# Altium schematic sheet TOP_Sheet.SchDoc
size 431 x 279 mm; DrawnBy: Santiago Rodriguez; DocumentNumber: 2; Revision: V1; SheetNumber: 3; SheetTotal: 10
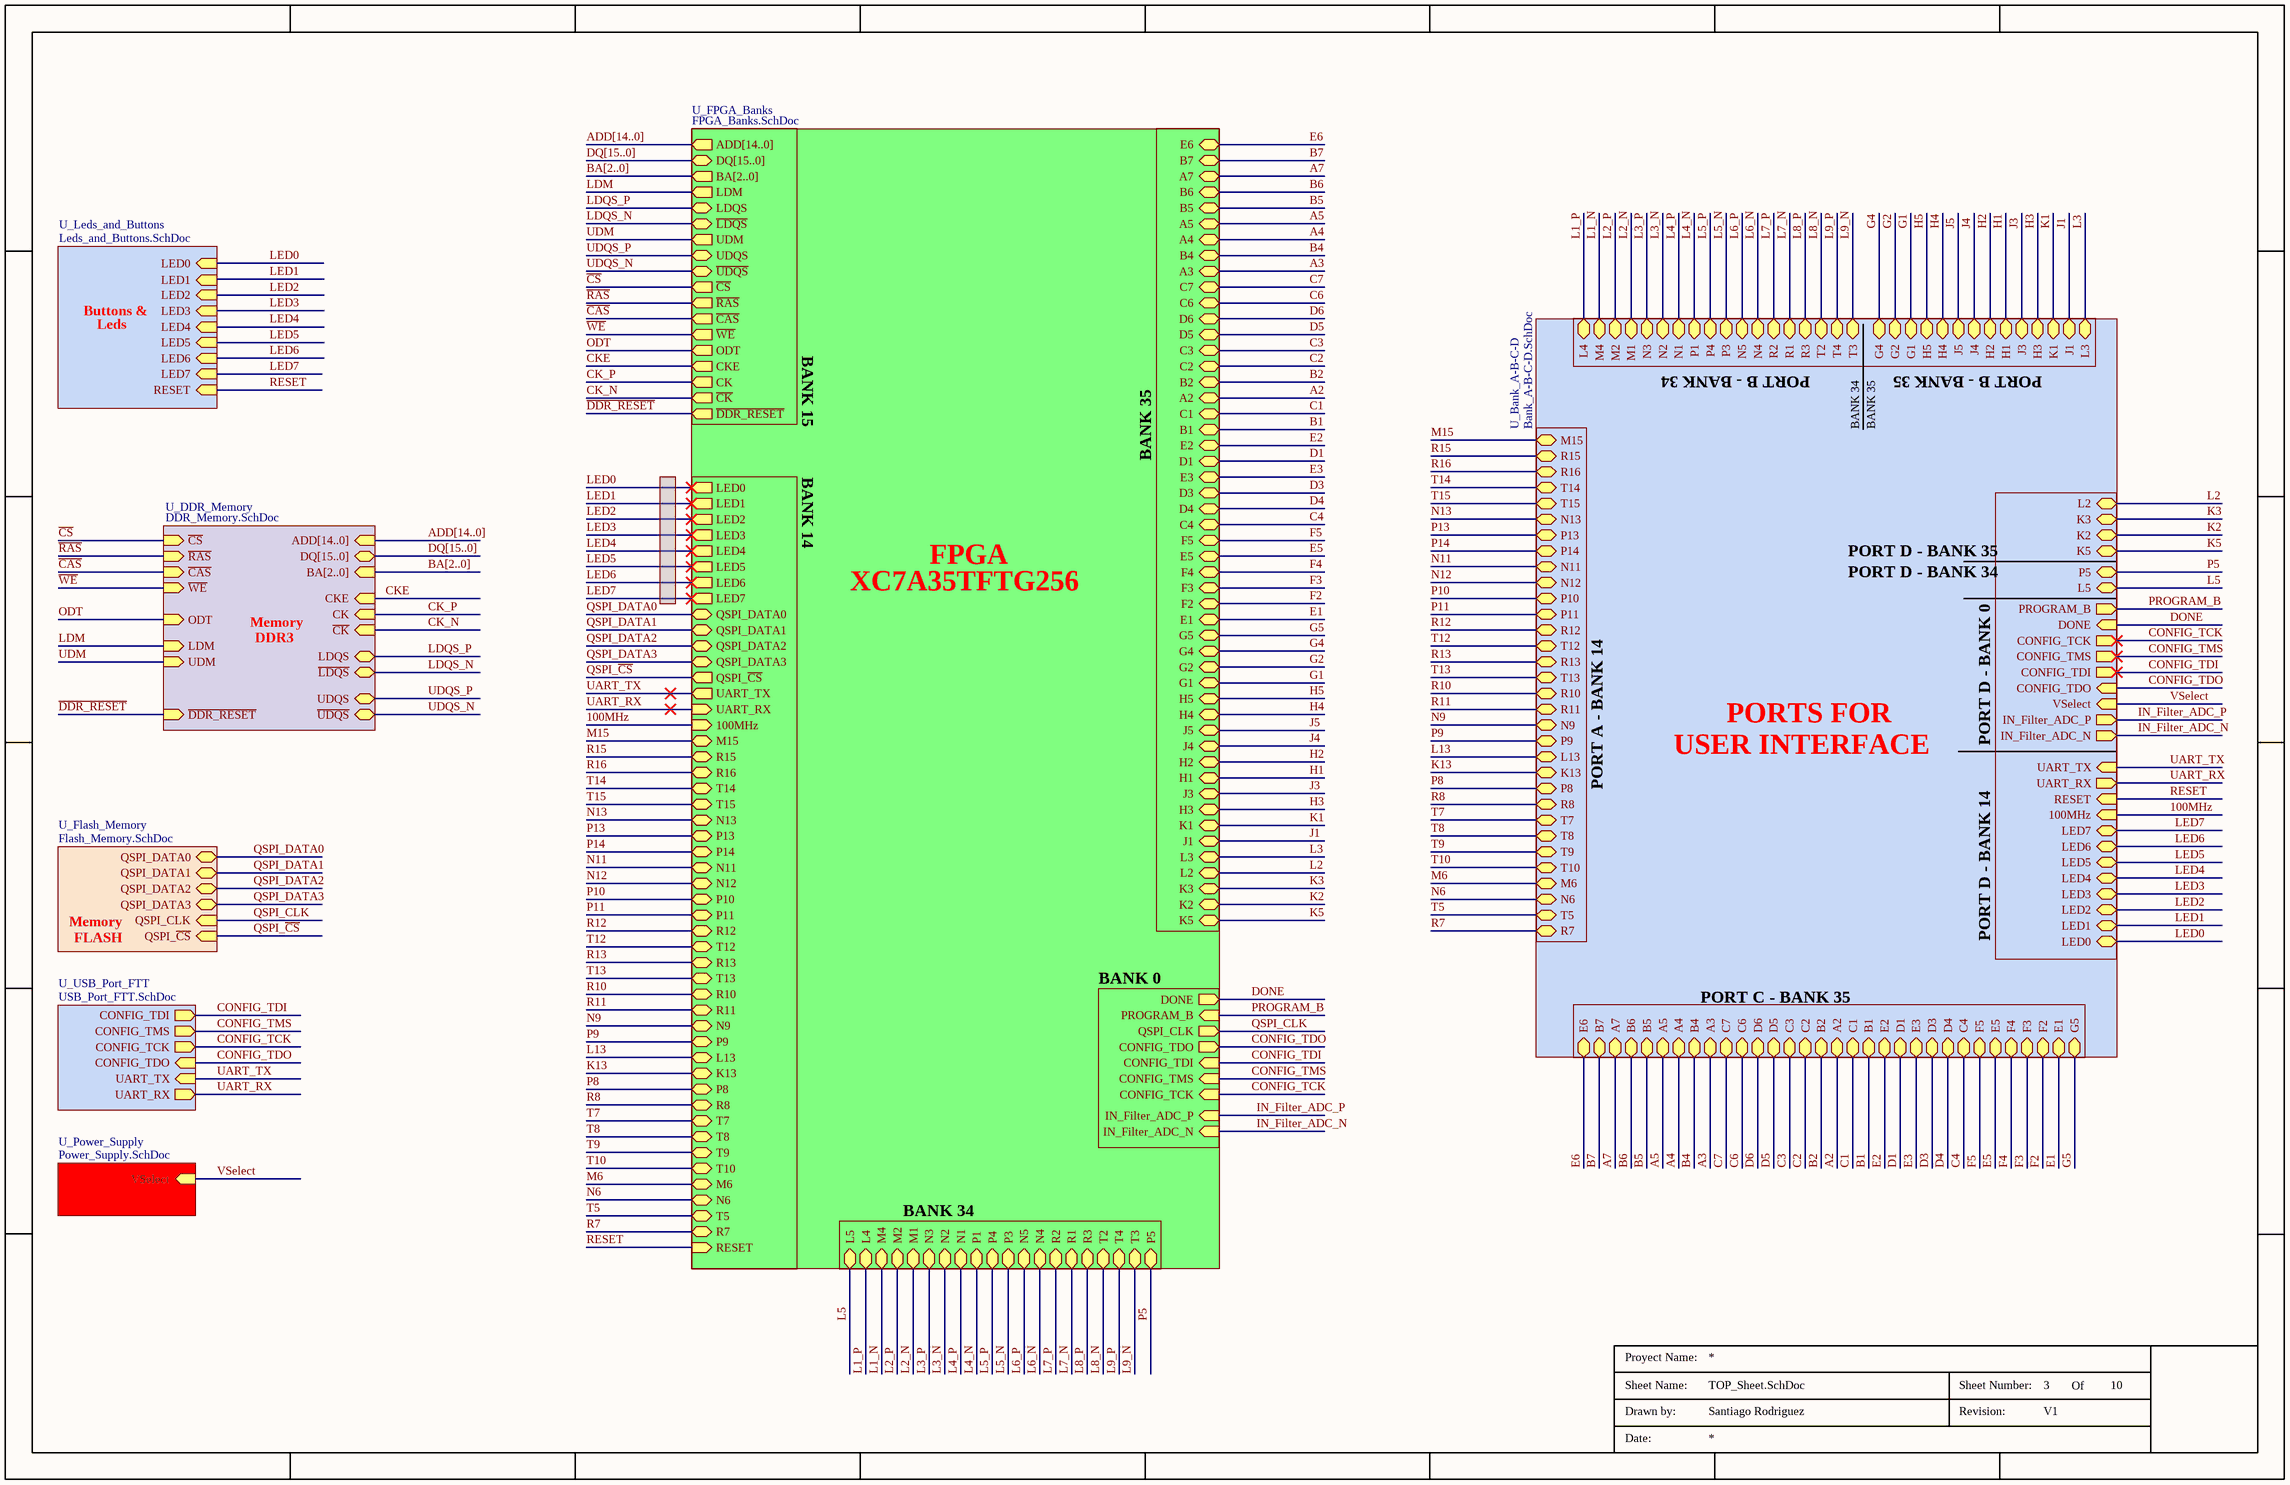
[diagram p0: TOP_Sheet.SchDoc]

## Sub-sheets
U_Bank_A-B-C-D = Bank_A-B-C-D.SchDoc: UART_TX (in), UART_RX (out), LED1 (bidir), LED2 (bidir), LED3 (bidir), LED4 (bidir), LED5 (bidir), LED6 (bidir), LED7 (bidir), 100MHz (in), LED0 (bidir), RESET (in), CONFIG_TDO (in), CONFIG_TDI (out), CONFIG_TMS (out), CONFIG_TCK (out), R1 (bidir), R2 (bidir), R3 (bidir), N1 (bidir), N2 (bidir), N3 (bidir), P1 (bidir), N4 (bidir), N5 (bidir), P3 (bidir), P4 (bidir), M1 (bidir), M2 (bidir), L4 (bidir), L5 (bidir), M4 (bidir), T2 (bidir), T3 (bidir), T4 (bidir), P5 (bidir), E6 (bidir), B7 (bidir), A7 (bidir), B5 (bidir), B6 (bidir), A4 (bidir), A5 (bidir), B4 (bidir), A3 (bidir), C1 (bidir), D1 (bidir), D3 (bidir), D4 (bidir), C2 (bidir), C3 (bidir), C4 (bidir), E5 (bidir), F4 (bidir), F5 (bidir), F2 (bidir), F3 (bidir), G1 (bidir), G2 (bidir), E1 (bidir), G4 (bidir), G5 (bidir), E2 (bidir), E3 (bidir), B1 (bidir), B2 (bidir), A2 (bidir), C6 (bidir), C7 (bidir), D5 (bidir), D6 (bidir), J1 (bidir), K1 (bidir), H1 (bidir), H2 (bidir), L2 (bidir), L3 (bidir), K2 (bidir), K3 (bidir), K5 (bidir), H3 (bidir), H4 (bidir), H5 (bidir), J3 (bidir), J4 (bidir), J5 (bidir), DONE (in), PROGRAM_B (out), IN_Filter_ADC_P (out), IN_Filter_ADC_N (out), VSelect (in), K13 (bidir), R15 (bidir), R16 (bidir), T14 (bidir), T15 (bidir), N13 (bidir), P13 (bidir), P14 (bidir), N11 (bidir), N12 (bidir), P10 (bidir), P11 (bidir), R12 (bidir), T12 (bidir), R13 (bidir), T13 (bidir), R10 (bidir), R11 (bidir), N9 (bidir), P9 (bidir), M6 (bidir), L13 (bidir), P8 (bidir), R8 (bidir), T7 (bidir), T8 (bidir), T9 (bidir), T10 (bidir), T5 (bidir), N6 (bidir), M15 (bidir), R7 (bidir)
U_DDR_Memory = DDR_Memory.SchDoc: CKE (in), ~{CK} (in), CK (in), ~{CS} (in), ~{RAS} (in), ~{CAS} (in), ~{WE} (in), ADD[14..0] (in), DQ[15..0] (bidir), LDQS (bidir), ~{LDQS} (bidir), UDQS (bidir), ~{UDQS} (bidir), ODT (in), ~{DDR_RESET} (in), LDM (in), UDM (in), BA[2..0] (in)
U_Flash_Memory = Flash_Memory.SchDoc: QSPI_DATA0 (bidir), QSPI_DATA1 (bidir), QSPI_DATA2 (bidir), QSPI_DATA3 (bidir), QSPI_CLK (in), QSPI_~{CS} (in)
U_FPGA_Banks = FPGA_Banks.SchDoc: QSPI_DATA0 (bidir), QSPI_DATA1 (bidir), QSPI_DATA2 (bidir), QSPI_DATA3 (bidir), QSPI_~{CS} (out), UART_TX (out), UART_RX (in), LED1 (out), LED2 (out), LED3 (out), LED4 (out), LED5 (out), LED6 (out), LED7 (out), K13 (bidir), 100MHz (in), R15 (bidir), R16 (bidir), T14 (bidir), T15 (bidir), N13 (bidir), P13 (bidir), P14 (bidir), N11 (bidir), N12 (bidir), P10 (bidir), P11 (bidir), R12 (bidir), T12 (bidir), R13 (bidir), T13 (bidir), R10 (bidir), R11 (bidir), N9 (bidir), P9 (bidir), M6 (bidir), L13 (bidir), P8 (bidir), R8 (bidir), T7 (bidir), T8 (bidir), T9 (bidir), T10 (bidir), T5 (bidir), N6 (bidir), M15 (bidir), R7 (bidir), RESET (in), ODT (out), ~{DDR_RESET} (out), ADD[14..0] (out), BA[2..0] (out), CKE (out), ~{CK} (out), CK (out), ~{CS} (out), ~{RAS} (out), ~{CAS} (out), ~{WE} (out), E6 (bidir), B7 (bidir), A7 (bidir), B5 (bidir), B6 (bidir), A4 (bidir), A5 (bidir), B4 (bidir), A3 (bidir), C1 (bidir), D1 (bidir), D3 (bidir), D4 (bidir), C2 (bidir), C3 (bidir), C4 (bidir), E5 (bidir), F4 (bidir), F5 (bidir), F2 (bidir), F3 (bidir), G1 (bidir), G2 (bidir), E1 (bidir), G4 (bidir), G5 (bidir), E2 (bidir), E3 (bidir), B1 (bidir), B2 (bidir), A2 (bidir), C6 (bidir), C7 (bidir), D5 (bidir), D6 (bidir), J1 (bidir), K1 (bidir), H1 (bidir), H2 (bidir), L2 (bidir), L3 (bidir), K2 (bidir), K3 (bidir), K5 (bidir), H3 (bidir), H4 (bidir), H5 (bidir), J3 (bidir), J4 (bidir), J5 (bidir), DQ[15..0] (bidir), LDQS (bidir), ~{LDQS} (bidir), UDQS (bidir), ~{UDQS} (bidir), UDM (out), LDM (out), LED0 (out), R1 (bidir), R2 (bidir), R3 (bidir), N1 (bidir), N2 (bidir), N3 (bidir), P1 (bidir), N4 (bidir), N5 (bidir), P3 (bidir), P4 (bidir), M1 (bidir), M2 (bidir), L4 (bidir), L5 (bidir), M4 (bidir), T2 (bidir), T3 (bidir), T4 (bidir), P5 (bidir), CONFIG_TDO (out), CONFIG_TDI (in), CONFIG_TMS (in), CONFIG_TCK (in), QSPI_CLK (out), DONE (out), PROGRAM_B (in), IN_Filter_ADC_P (in), IN_Filter_ADC_N (in)
U_Leds_and_Buttons = Leds_and_Buttons.SchDoc: LED0 (in), LED1 (in), LED2 (in), LED3 (in), LED4 (in), LED5 (in), LED6 (in), LED7 (in), RESET (in)
U_Power_Supply = Power_Supply.SchDoc: VSelect (in)
U_USB_Port_FTT = USB_Port_FTT.SchDoc: CONFIG_TDO (in), CONFIG_TDI (out), CONFIG_TMS (out), CONFIG_TCK (out), UART_TX (in), UART_RX (out)

## Nets
100MHz: sheet U_Bank_A-B-C-D/100MHz, sheet U_FPGA_Banks/100MHz
A2: sheet U_Bank_A-B-C-D/A2, sheet U_FPGA_Banks/A2
A3: sheet U_Bank_A-B-C-D/A3, sheet U_FPGA_Banks/A3
A4: sheet U_Bank_A-B-C-D/A4, sheet U_FPGA_Banks/A4
A5: sheet U_Bank_A-B-C-D/A5, sheet U_FPGA_Banks/A5
A7: sheet U_Bank_A-B-C-D/A7, sheet U_FPGA_Banks/A7
B1: sheet U_Bank_A-B-C-D/B1, sheet U_FPGA_Banks/B1
B2: sheet U_Bank_A-B-C-D/B2, sheet U_FPGA_Banks/B2
B4: sheet U_Bank_A-B-C-D/B4, sheet U_FPGA_Banks/B4
B5: sheet U_Bank_A-B-C-D/B5, sheet U_FPGA_Banks/B5
B6: sheet U_Bank_A-B-C-D/B6, sheet U_FPGA_Banks/B6
B7: sheet U_Bank_A-B-C-D/B7, sheet U_FPGA_Banks/B7
C1: sheet U_Bank_A-B-C-D/C1, sheet U_FPGA_Banks/C1
C2: sheet U_Bank_A-B-C-D/C2, sheet U_FPGA_Banks/C2
C3: sheet U_Bank_A-B-C-D/C3, sheet U_FPGA_Banks/C3
C4: sheet U_Bank_A-B-C-D/C4, sheet U_FPGA_Banks/C4
C6: sheet U_Bank_A-B-C-D/C6, sheet U_FPGA_Banks/C6
C7: sheet U_Bank_A-B-C-D/C7, sheet U_FPGA_Banks/C7
~{CAS}: sheet U_DDR_Memory/~{CAS}, sheet U_FPGA_Banks/~{CAS}
~{CS}: sheet U_DDR_Memory/~{CS}, sheet U_FPGA_Banks/~{CS}
CK_N: sheet U_DDR_Memory/~{CK}, sheet U_FPGA_Banks/~{CK}
CK_P: sheet U_DDR_Memory/CK, sheet U_FPGA_Banks/CK
CKE: sheet U_DDR_Memory/CKE, sheet U_FPGA_Banks/CKE
CONFIG_TCK: sheet U_Bank_A-B-C-D/CONFIG_TCK, sheet U_FPGA_Banks/CONFIG_TCK, sheet U_USB_Port_FTT/CONFIG_TCK
CONFIG_TDI: sheet U_Bank_A-B-C-D/CONFIG_TDI, sheet U_FPGA_Banks/CONFIG_TDI, sheet U_USB_Port_FTT/CONFIG_TDI
CONFIG_TDO: sheet U_Bank_A-B-C-D/CONFIG_TDO, sheet U_FPGA_Banks/CONFIG_TDO, sheet U_USB_Port_FTT/CONFIG_TDO
CONFIG_TMS: sheet U_Bank_A-B-C-D/CONFIG_TMS, sheet U_FPGA_Banks/CONFIG_TMS, sheet U_USB_Port_FTT/CONFIG_TMS
D1: sheet U_Bank_A-B-C-D/D1, sheet U_FPGA_Banks/D1
D3: sheet U_Bank_A-B-C-D/D3, sheet U_FPGA_Banks/D3
D4: sheet U_Bank_A-B-C-D/D4, sheet U_FPGA_Banks/D4
D5: sheet U_Bank_A-B-C-D/D5, sheet U_FPGA_Banks/D5
D6: sheet U_Bank_A-B-C-D/D6, sheet U_FPGA_Banks/D6
~{DDR_RESET}: sheet U_DDR_Memory/~{DDR_RESET}, sheet U_FPGA_Banks/~{DDR_RESET}
DONE: sheet U_Bank_A-B-C-D/DONE, sheet U_FPGA_Banks/DONE
E1: sheet U_Bank_A-B-C-D/E1, sheet U_FPGA_Banks/E1
E2: sheet U_Bank_A-B-C-D/E2, sheet U_FPGA_Banks/E2
E3: sheet U_Bank_A-B-C-D/E3, sheet U_FPGA_Banks/E3
E5: sheet U_Bank_A-B-C-D/E5, sheet U_FPGA_Banks/E5
E6: sheet U_Bank_A-B-C-D/E6, sheet U_FPGA_Banks/E6
F2: sheet U_Bank_A-B-C-D/F2, sheet U_FPGA_Banks/F2
F3: sheet U_Bank_A-B-C-D/F3, sheet U_FPGA_Banks/F3
F4: sheet U_Bank_A-B-C-D/F4, sheet U_FPGA_Banks/F4
F5: sheet U_Bank_A-B-C-D/F5, sheet U_FPGA_Banks/F5
G1: sheet U_Bank_A-B-C-D/G1, sheet U_FPGA_Banks/G1
G2: sheet U_Bank_A-B-C-D/G2, sheet U_FPGA_Banks/G2
G4: sheet U_Bank_A-B-C-D/G4, sheet U_FPGA_Banks/G4
G5: sheet U_Bank_A-B-C-D/G5, sheet U_FPGA_Banks/G5
H1: sheet U_Bank_A-B-C-D/H1, sheet U_FPGA_Banks/H1
H2: sheet U_Bank_A-B-C-D/H2, sheet U_FPGA_Banks/H2
H3: sheet U_Bank_A-B-C-D/H3, sheet U_FPGA_Banks/H3
H4: sheet U_Bank_A-B-C-D/H4, sheet U_FPGA_Banks/H4
H5: sheet U_Bank_A-B-C-D/H5, sheet U_FPGA_Banks/H5
IN_Filter_ADC_N: sheet U_Bank_A-B-C-D/IN_Filter_ADC_N, sheet U_FPGA_Banks/IN_Filter_ADC_N
IN_Filter_ADC_P: sheet U_Bank_A-B-C-D/IN_Filter_ADC_P, sheet U_FPGA_Banks/IN_Filter_ADC_P
J1: sheet U_Bank_A-B-C-D/J1, sheet U_FPGA_Banks/J1
J3: sheet U_Bank_A-B-C-D/J3, sheet U_FPGA_Banks/J3
J4: sheet U_Bank_A-B-C-D/J4, sheet U_FPGA_Banks/J4
J5: sheet U_Bank_A-B-C-D/J5, sheet U_FPGA_Banks/J5
K1: sheet U_Bank_A-B-C-D/K1, sheet U_FPGA_Banks/K1
K2: sheet U_Bank_A-B-C-D/K2, sheet U_FPGA_Banks/K2
K3: sheet U_Bank_A-B-C-D/K3, sheet U_FPGA_Banks/K3
K5: sheet U_Bank_A-B-C-D/K5, sheet U_FPGA_Banks/K5
K13: sheet U_Bank_A-B-C-D/K13, sheet U_FPGA_Banks/K13
L1_N: sheet U_Bank_A-B-C-D/M4, sheet U_FPGA_Banks/M4
L1_P: sheet U_Bank_A-B-C-D/L4, sheet U_FPGA_Banks/L4
L2: sheet U_Bank_A-B-C-D/L2, sheet U_FPGA_Banks/L2
L2_N: sheet U_Bank_A-B-C-D/M1, sheet U_FPGA_Banks/M1
L2_P: sheet U_Bank_A-B-C-D/M2, sheet U_FPGA_Banks/M2
L3: sheet U_Bank_A-B-C-D/L3, sheet U_FPGA_Banks/L3
L3_N: sheet U_Bank_A-B-C-D/N2, sheet U_FPGA_Banks/N2
L3_P: sheet U_Bank_A-B-C-D/N3, sheet U_FPGA_Banks/N3
L4_N: sheet U_Bank_A-B-C-D/P1, sheet U_FPGA_Banks/P1
L4_P: sheet U_Bank_A-B-C-D/N1, sheet U_FPGA_Banks/N1
L5: sheet U_Bank_A-B-C-D/L5, sheet U_FPGA_Banks/L5
L5_N: sheet U_Bank_A-B-C-D/P3, sheet U_FPGA_Banks/P3
L5_P: sheet U_Bank_A-B-C-D/P4, sheet U_FPGA_Banks/P4
L6_N: sheet U_Bank_A-B-C-D/N4, sheet U_FPGA_Banks/N4
L6_P: sheet U_Bank_A-B-C-D/N5, sheet U_FPGA_Banks/N5
L7_N: sheet U_Bank_A-B-C-D/R1, sheet U_FPGA_Banks/R1
L7_P: sheet U_Bank_A-B-C-D/R2, sheet U_FPGA_Banks/R2
L8_N: sheet U_Bank_A-B-C-D/T2, sheet U_FPGA_Banks/T2
L8_P: sheet U_Bank_A-B-C-D/R3, sheet U_FPGA_Banks/R3
L9_N: sheet U_Bank_A-B-C-D/T3, sheet U_FPGA_Banks/T3
L9_P: sheet U_Bank_A-B-C-D/T4, sheet U_FPGA_Banks/T4
L13: sheet U_Bank_A-B-C-D/L13, sheet U_FPGA_Banks/L13
LDM: sheet U_DDR_Memory/LDM, sheet U_FPGA_Banks/LDM
LDQS_N: sheet U_DDR_Memory/~{LDQS}, sheet U_FPGA_Banks/~{LDQS}
LDQS_P: sheet U_DDR_Memory/LDQS, sheet U_FPGA_Banks/LDQS
LED0: sheet U_Bank_A-B-C-D/LED0, sheet U_FPGA_Banks/LED0, sheet U_Leds_and_Buttons/LED0
LED1: sheet U_Bank_A-B-C-D/LED1, sheet U_FPGA_Banks/LED1
LED2: sheet U_Bank_A-B-C-D/LED2, sheet U_FPGA_Banks/LED2, sheet U_Leds_and_Buttons/LED2
LED3: sheet U_Bank_A-B-C-D/LED3, sheet U_FPGA_Banks/LED3, sheet U_Leds_and_Buttons/LED3
LED4: sheet U_Bank_A-B-C-D/LED4, sheet U_FPGA_Banks/LED4, sheet U_Leds_and_Buttons/LED4
LED5: sheet U_Bank_A-B-C-D/LED5, sheet U_FPGA_Banks/LED5, sheet U_Leds_and_Buttons/LED5
LED6: sheet U_Bank_A-B-C-D/LED6, sheet U_FPGA_Banks/LED6, sheet U_Leds_and_Buttons/LED6
LED7: sheet U_Bank_A-B-C-D/LED7, sheet U_FPGA_Banks/LED7, sheet U_Leds_and_Buttons/LED7
M6: sheet U_Bank_A-B-C-D/M6, sheet U_FPGA_Banks/M6
M15: sheet U_Bank_A-B-C-D/M15, sheet U_FPGA_Banks/M15
N6: sheet U_Bank_A-B-C-D/N6, sheet U_FPGA_Banks/N6
N9: sheet U_Bank_A-B-C-D/N9, sheet U_FPGA_Banks/N9
N11: sheet U_Bank_A-B-C-D/N11, sheet U_FPGA_Banks/N11
N12: sheet U_Bank_A-B-C-D/N12, sheet U_FPGA_Banks/N12
N13: sheet U_Bank_A-B-C-D/N13, sheet U_FPGA_Banks/N13
ODT: sheet U_DDR_Memory/ODT, sheet U_FPGA_Banks/ODT
P5: sheet U_Bank_A-B-C-D/P5, sheet U_FPGA_Banks/P5
P8: sheet U_Bank_A-B-C-D/P8, sheet U_FPGA_Banks/P8
P9: sheet U_Bank_A-B-C-D/P9, sheet U_FPGA_Banks/P9
P10: sheet U_Bank_A-B-C-D/P10, sheet U_FPGA_Banks/P10
P11: sheet U_Bank_A-B-C-D/P11, sheet U_FPGA_Banks/P11
P13: sheet U_Bank_A-B-C-D/P13, sheet U_FPGA_Banks/P13
P14: sheet U_Bank_A-B-C-D/P14, sheet U_FPGA_Banks/P14
PROGRAM_B: sheet U_Bank_A-B-C-D/PROGRAM_B, sheet U_FPGA_Banks/PROGRAM_B
QSPI_~{CS}: sheet U_Flash_Memory/QSPI_~{CS}, sheet U_FPGA_Banks/QSPI_~{CS}
QSPI_CLK: sheet U_Flash_Memory/QSPI_CLK, sheet U_FPGA_Banks/QSPI_CLK
QSPI_DATA0: sheet U_Flash_Memory/QSPI_DATA0, sheet U_FPGA_Banks/QSPI_DATA0
QSPI_DATA1: sheet U_Flash_Memory/QSPI_DATA1, sheet U_FPGA_Banks/QSPI_DATA1
QSPI_DATA2: sheet U_Flash_Memory/QSPI_DATA2, sheet U_FPGA_Banks/QSPI_DATA2
QSPI_DATA3: sheet U_Flash_Memory/QSPI_DATA3, sheet U_FPGA_Banks/QSPI_DATA3
R7: sheet U_Bank_A-B-C-D/R7, sheet U_FPGA_Banks/R7
R8: sheet U_Bank_A-B-C-D/R8, sheet U_FPGA_Banks/R8
R10: sheet U_Bank_A-B-C-D/R10, sheet U_FPGA_Banks/R10
R11: sheet U_Bank_A-B-C-D/R11, sheet U_FPGA_Banks/R11
R12: sheet U_Bank_A-B-C-D/R12, sheet U_FPGA_Banks/R12
R13: sheet U_Bank_A-B-C-D/R13, sheet U_FPGA_Banks/R13
R15: sheet U_Bank_A-B-C-D/R15, sheet U_FPGA_Banks/R15
R16: sheet U_Bank_A-B-C-D/R16, sheet U_FPGA_Banks/R16
~{RAS}: sheet U_DDR_Memory/~{RAS}, sheet U_FPGA_Banks/~{RAS}
RESET: sheet U_Bank_A-B-C-D/RESET, sheet U_FPGA_Banks/RESET, sheet U_Leds_and_Buttons/RESET
T5: sheet U_Bank_A-B-C-D/T5, sheet U_FPGA_Banks/T5
T7: sheet U_Bank_A-B-C-D/T7, sheet U_FPGA_Banks/T7
T8: sheet U_Bank_A-B-C-D/T8, sheet U_FPGA_Banks/T8
T9: sheet U_Bank_A-B-C-D/T9, sheet U_FPGA_Banks/T9
T10: sheet U_Bank_A-B-C-D/T10, sheet U_FPGA_Banks/T10
T12: sheet U_Bank_A-B-C-D/T12, sheet U_FPGA_Banks/T12
T13: sheet U_Bank_A-B-C-D/T13, sheet U_FPGA_Banks/T13
T14: sheet U_Bank_A-B-C-D/T14, sheet U_FPGA_Banks/T14
T15: sheet U_Bank_A-B-C-D/T15, sheet U_FPGA_Banks/T15
UART_RX: sheet U_Bank_A-B-C-D/UART_RX, sheet U_FPGA_Banks/UART_RX, sheet U_USB_Port_FTT/UART_RX
UART_TX: sheet U_Bank_A-B-C-D/UART_TX, sheet U_FPGA_Banks/UART_TX, sheet U_USB_Port_FTT/UART_TX
UDM: sheet U_DDR_Memory/UDM, sheet U_FPGA_Banks/UDM
UDQS_N: sheet U_DDR_Memory/~{UDQS}, sheet U_FPGA_Banks/~{UDQS}
UDQS_P: sheet U_DDR_Memory/UDQS, sheet U_FPGA_Banks/UDQS
VSelect: sheet U_Bank_A-B-C-D/VSelect, sheet U_Power_Supply/VSelect
~{WE}: sheet U_DDR_Memory/~{WE}, sheet U_FPGA_Banks/~{WE}

## Buses and harness runs
bus ADD[14..0] = sheet U_DDR_Memory/ADD[14..0]
bus ADD[14..0] = sheet U_FPGA_Banks/ADD[14..0]
bus BA[2..0] = sheet U_DDR_Memory/BA[2..0]
bus BA[2..0] = sheet U_FPGA_Banks/BA[2..0]
bus DQ[15..0] = sheet U_DDR_Memory/DQ[15..0]
bus DQ[15..0] = sheet U_FPGA_Banks/DQ[15..0]

## Notes on the sheet
- Buttons &
- Leds
- BANK 15
- PORT B - BANK 34
- PORT B - BANK 35
- BANK 34
- BANK 35
- BANK 14
- FPGA
- PORT D - BANK 35
- Memory
- XC7A35TFTG256
- PORT D - BANK 34
- DDR3
- USER INTERFACE
- PORTS FOR
- PORT D - BANK 0
- PORT A - BANK 14
- FLASH
- PORT D - BANK 14
- BANK 0
- PORT C - BANK 35
- Proyect Name:
- Sheet Name:
- Drawn by:
- Revision:
- Sheet Number:
- Of
- Date: